# EAGLE design motor_driver (EAGLE 7.4.0)
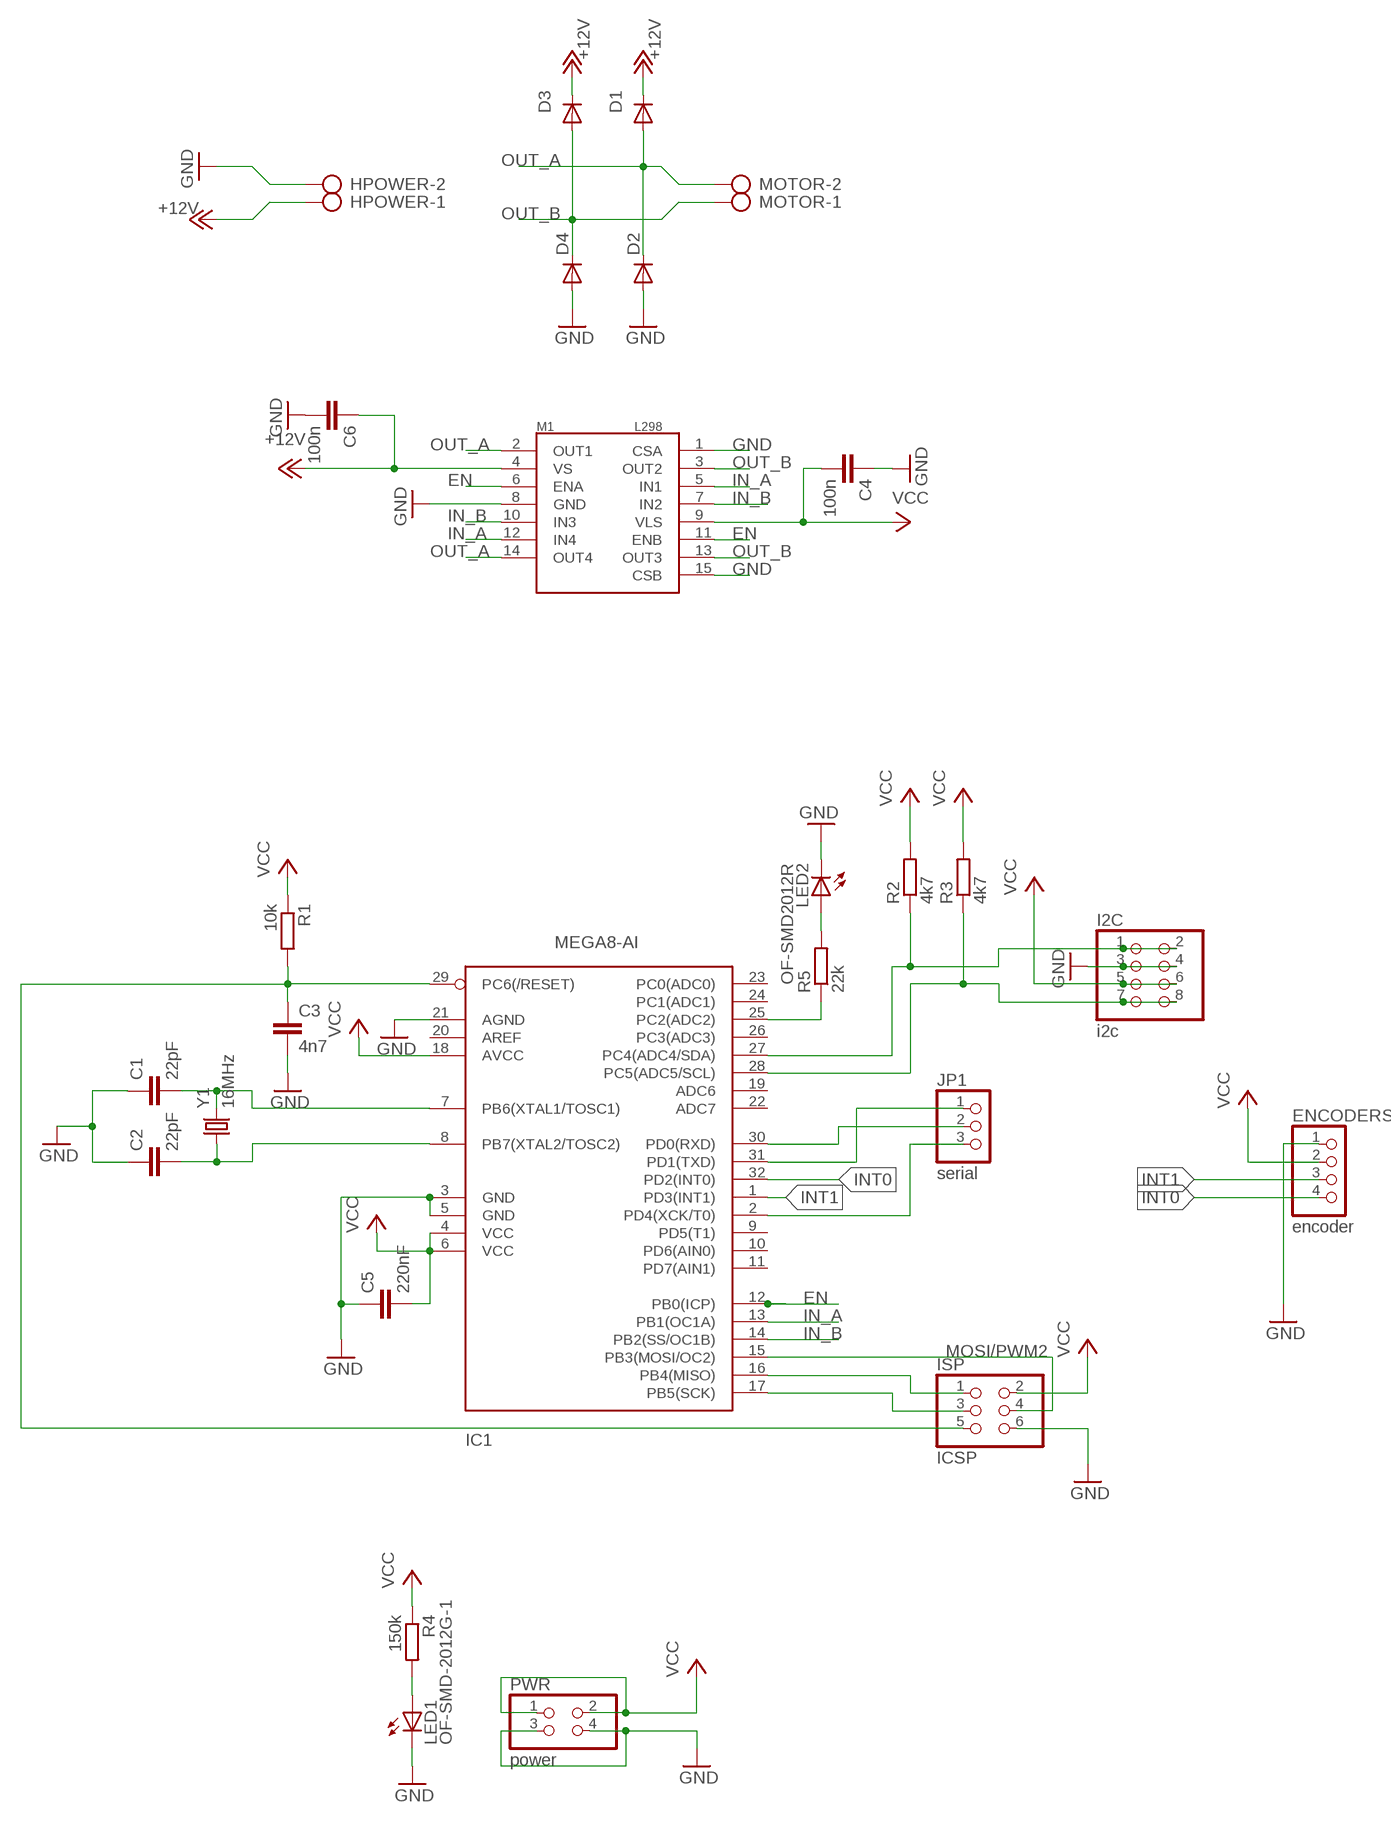
[diagram p0: schematic, sheet 1]

## Parts
C1  22pF  C  [C0805]
C2  22pF  C  [C0805]
C3  4n7  CAP0805  [0805]
C4  100n  CAP0805  [0805]
C5  220nF  CAP0805  [0805]
C6  100n  C  [C0805]
D1  DIODE-SMB  [SMB]
D2  DIODE-SMB  [SMB]
D3  DIODE-SMB  [SMB]
D4  DIODE-SMB  [SMB]
ENCODERS  encoder  PINHD-1X04_2.54-S  [1X04-S]
HPOWER  AK500/2  [AK500/2]
I2C  i2c  PINHD-2X04_2.54  [2X04]
IC1  MEGA8-AI  [TQFP32-08]
ISP  ICSP  PINHD-2X03_2.54  [2X03]
JP1  serial  PINHD-1X03_2.54-S  [1X03-S]
LED1  OF-SMD-2012G-1  LEDCHIPLED_1206  [CHIPLED_1206]
LED2  OF-SMD2012R  LEDCHIPLED_1206  [CHIPLED_1206]
M1  L298  [MULTIWATT15]
MOTOR  AK500/2  [AK500/2]
PWR  power  PINHD-2X02_2.54  [2X02]
R1  10k  R  [R0805]
R2  4k7  R  [R0805]
R3  4k7  R  [R0805]
R4  150k  R  [R0805]
R5  22k  R  [R0805]
Y1  16MHz  CRYSTALSMD  [HC49UP]

## Nets
+12V: C6.1 D1.C D3.C HPOWER.1 M1.4(VS)
EN: IC1.12(PB0(ICP)) M1.6(ENA) M1.11(ENB)
GND: C1.1 C2.1 C3.2 C4.1 C5.1 C6.2 D2.A D4.A ENCODERS.1 HPOWER.2 I2C.3 I2C.4 IC1.3(GND) IC1.5(GND) IC1.21(AGND) ISP.6 LED1.C LED2.C M1.1(CSA) M1.8(GND) M1.15(CSB) PWR.3 PWR.4
IN_A: IC1.13(PB1(OC1A)) M1.5(IN1) M1.12(IN4)
IN_B: IC1.14(PB2(SS/OC1B)) M1.7(IN2) M1.10(IN3)
INT0: ENCODERS.4 IC1.32(PD2(INT0))
INT1: ENCODERS.3 IC1.1(PD3(INT1))
MISO: IC1.16(PB4(MISO)) ISP.1
MOSI/PWM2: IC1.15(PB3(MOSI/OC2)) ISP.4
N$1: IC1.31(PD1(TXD)) JP1.1
N$2: C2.2 IC1.8(PB7(XTAL2/TOSC2)) Y1.1
N$3: C1.2 IC1.7(PB6(XTAL1/TOSC1)) Y1.2
N$5: IC1.30(PD0(RXD)) JP1.2
N$6: IC1.2(PD4(XCK/T0)) JP1.3
N$7: IC1.25(PC2(ADC2)) R5.1
N$11: LED1.A R4.2
N$14: LED2.A R5.2
OUT_A: D1.A D2.C M1.2(OUT1) M1.14(OUT4) MOTOR.2
OUT_B: D3.A D4.C M1.3(OUT2) M1.13(OUT3) MOTOR.1
RESET: C3.1 IC1.29(PC6(/RESET)) ISP.5 R1.2
SCK: IC1.17(PB5(SCK)) ISP.3
SCL: I2C.7 I2C.8 IC1.28(PC5(ADC5/SCL)) R3.1
SDA: I2C.1 I2C.2 IC1.27(PC4(ADC4/SDA)) R2.1
VCC: C4.2 C5.2 ENCODERS.2 I2C.5 I2C.6 IC1.4(VCC) IC1.6(VCC) IC1.18(AVCC) ISP.2 M1.9(VLS) PWR.1 PWR.2 R1.1 R2.2 R3.2 R4.1
Unconnected: IC1.9(PD5(T1)) IC1.10(PD6(AIN0)) IC1.11(PD7(AIN1)) IC1.19(ADC6) IC1.20(AREF) IC1.22(ADC7) IC1.23(PC0(ADC0)) IC1.24(PC1(ADC1)) IC1.26(PC3(ADC3))

## Library data of the parts
C1 C2 C6 = eagle-ltspice:C: CAPACITOR, European symbol; SPICEMODEL: NONE; SPICEPREFIX: C
C3-C5 = SparkFun-Capacitors:CAP: Capacitor Standard 0603 ceramic capacitor, and 0.1" leaded capacitor.
D1-D4 = diode:DIODE-: DIODE
ENCODERS = pinhead-2:PINHD-1X04: PIN HEADER
HPOWER MOTOR = con-ptr500:AK500/2: CONNECTOR; OC_FARNELL: unknown; OC_NEWARK: unknown
I2C = pinhead-2:PINHD-2X04: PIN HEADER
IC1 = avr-7:MEGA8: MICROCONTROLLER 8 Kbytes FLASH 1 kbytes SRAM 512 bytes EEPROM USART 6-channel 10 bit ADC 2-channel 8 bit ADC
ISP = pinhead-2:PINHD-2X03: PIN HEADER
JP1 = pinhead-2:PINHD-1X03: PIN HEADER
LED1 LED2 = adafruit:LED: LED OSRAM: - CHIPLED LG R971, LG N971, LY N971, LG Q971, LY Q971, LO R971, LY R971 LH N974, LH R974 LS Q976, LO Q976, LY Q976 LO Q996 - Hyper CHIPLED LW Q18S LB Q993, LB Q99A, LB R99A - SideLED LS A670, LO A670, LY A670, LG A670, LP A670 LB A673, LV A673, LT A673, LW A673 LH A674 LY A675 LS A676, LA A676, LO A676, LY A676, LW A676 LS A679, LY A679, LG A679 - Hyper Micro SIDELED® LS Y876, LA Y876, LO Y876, LY Y876 LT Y87S - SmartLED LW L88C, LW L88S LB L89C, LB L89S, LG L890 LS L89K, LO L89K, LY L89K LS L896, LA L896, LO L896, LY L896 - TOPLED LS T670, LO T670, LY T670, LG T670, LP T670 LSG T670, LSP T670, LSY T670, LOP T670, LYG T670 LG T671, LOG T671, LSG T671 LB T673, LV T673, LT T673, LW T673 LH T674 LS T676, LA T676, LO T676, LY T676, LB T676, LH T676, LSB T676, LW T676 LB T67C, LV T67C, LT T67C, LS T67K, LO T67K, LY T67K, LW E67C LS E67B, LA E67B, LO E67B, LY E67B, LB E67C, LV E67C, LT E67C LW T67C LS T679, LY T679, LG T679 LS T770, LO T770, LY T770, LG T770, LP T770 LB T773, LV T773, LT T773, LW T773 LH T774 LS E675, LA E675, LY E675, LS T675 LS T776, LA T776, LO T776, LY T776, LB T776 LHGB T686 LT T68C, LB T68C - Hyper Mini TOPLED® LB M676 - Mini TOPLED Santana® LG M470 LS M47K, LO M47K, LY M47K Source: http://www.osram.convergy.de/
M1 = SparkFun:L298: L298 Dual Full Bridge Driver
PWR = pinhead-2:PINHD-2X02: PIN HEADER
R1-R5 = eagle-ltspice:R: RESISTOR, European symbol; SPICEMODEL: NONE; SPICEPREFIX: R
Y1 = SparkFun-FreqCtrl:CRYSTAL: Various standard crystals. Proven footprints.

## Board
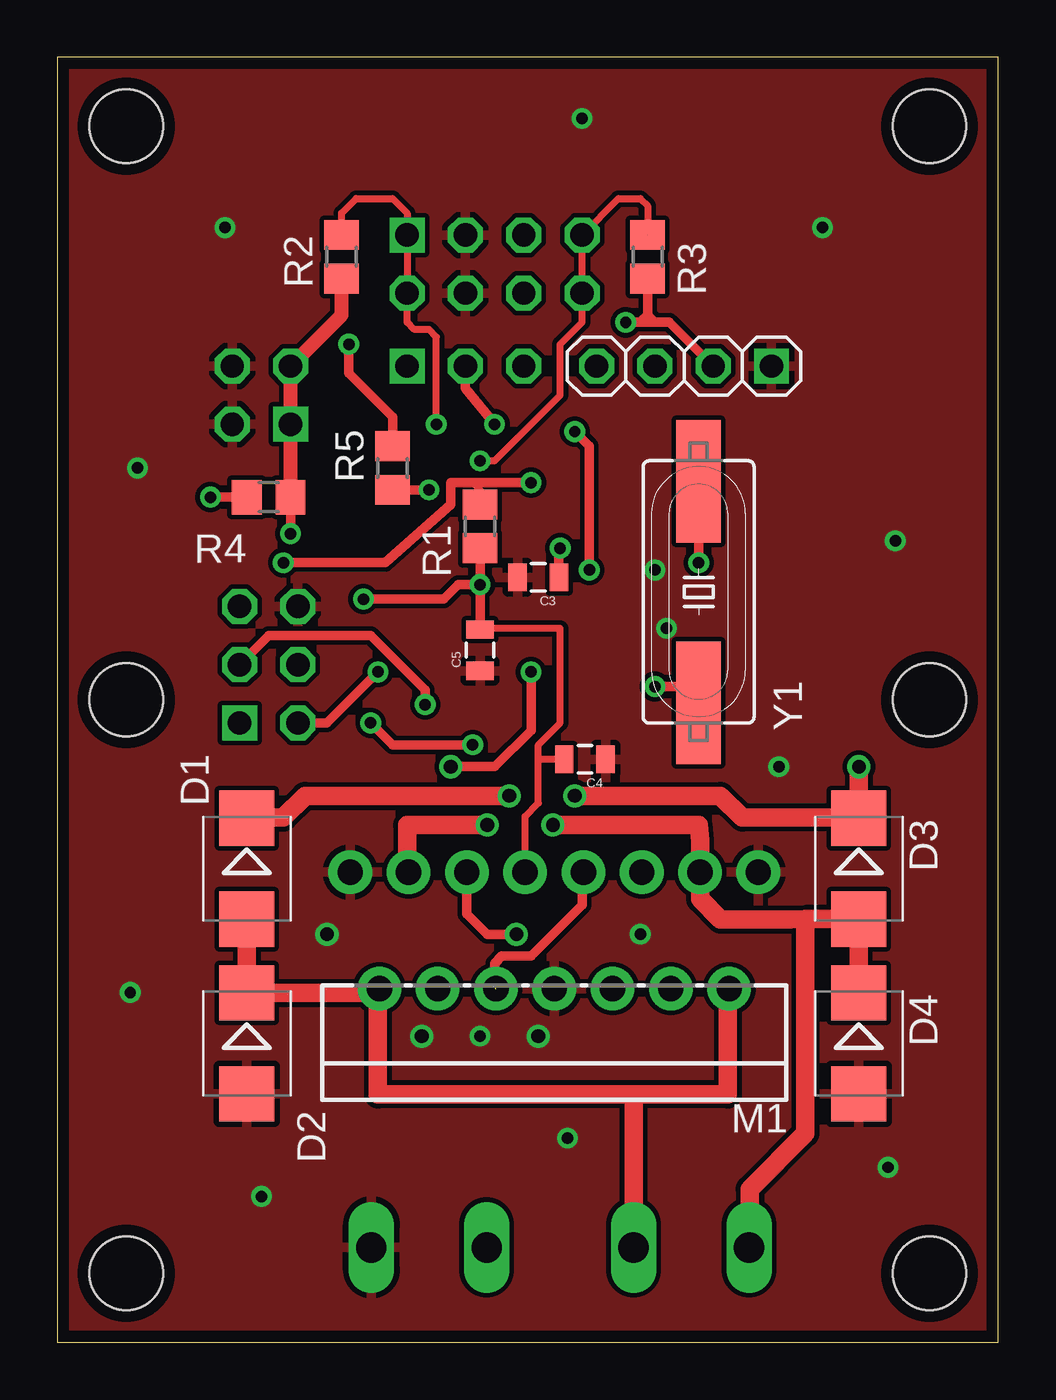
[diagram p1: board, top side]
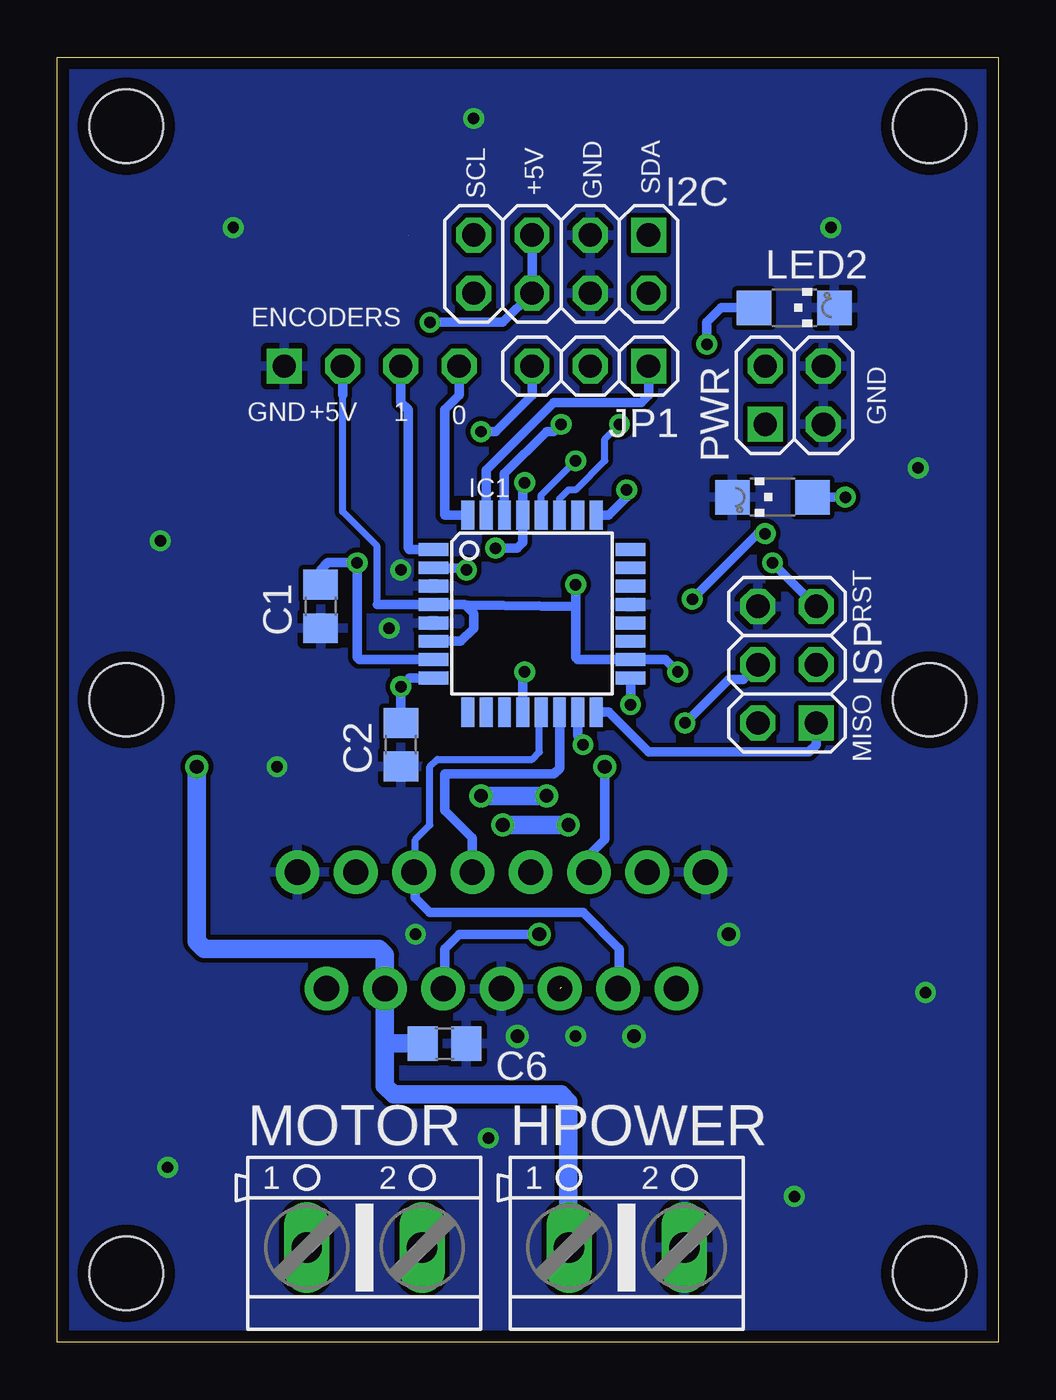
[diagram p2: board, bottom side, seen from below]

Size 41 x 56 mm. Coordinates in mm from the lower left corner, seen from the top.
Outline: 0,0 41,0 41,56 0,56 0,0
Copper layers (1*16): Top 0.035mm / dielectric 1.6mm / Bottom 0.035mm
Design rules "iteadstudio": minimum track width 8mil, minimum drill 12mil, track to track 8mil, track to pad 10mil, pad to pad 8mil, via to via 8mil, smd to smd 8mil, copper to edge 20mil, drill to drill 12mil, minimum pad ring 8mil, minimum via ring 8mil, stop-mask expansion 4mil, vias tented up to drill 0mil, thermal gap 10mil
Holes 3.2 mm at 3,3 38,3 38,53 3,53 38,28 3,28

### Footprints (pad centres in the part's own frame; a part is rotated, then mirrored left to right if it is on the bottom)
C0805 = smd 1.3 x 1.5: 1 -0.95,0; 2 0.95,0
0805 = smd 0.8 x 1.2: 1 -0.9,0; 2 0.9,0
SMB = smd 2.4 x 2.4: A 2.2,0; C -2.2,0
1X04-S = drill 1.016 square: 1 -3.81,0 | drill 1.016 octagon: 2 -1.27,0; 3 1.27,0; 4 3.81,0
AK500/2 = drill 1.321 long: 1 -2.515,0; 2 2.515,0
2X04 = drill 1.016 square: 1 -3.81,-1.27 | drill 1.016 octagon: 2 -3.81,1.27; 3 -1.27,-1.27; 4 -1.27,1.27; 5 1.27,-1.27; 6 1.27,1.27; 7 3.81,-1.27; 8 3.81,1.27
TQFP32-08 = smd 1.27 x 0.559: 1 -4.293,2.8; 2 -4.293,2; 3 -4.293,1.2; 4 -4.293,0.4; 5 -4.293,-0.4; 6 -4.293,-1.2; 7 -4.293,-2; 8 -4.293,-2.8; 17 4.293,-2.8; 18 4.293,-2; 19 4.293,-1.2; 20 4.293,-0.4; 21 4.293,0.4; 22 4.293,1.2; 23 4.293,2; 24 4.293,2.8 | smd 0.559 x 1.27: 9 -2.8,-4.293; 10 -2,-4.293; 11 -1.2,-4.293; 12 -0.4,-4.293; 13 0.4,-4.293; 14 1.2,-4.293; 15 2,-4.293; 16 2.8,-4.293; 25 2.8,4.293; 26 2,4.293; 27 1.2,4.293; 28 0.4,4.293; 29 -0.4,4.293; 30 -1.2,4.293; 31 -2,4.293; 32 -2.8,4.293
2X03 = drill 1.016 square: 1 -2.54,-1.27 | drill 1.016 octagon: 2 -2.54,1.27; 3 0,-1.27; 4 0,1.27; 5 2.54,-1.27; 6 2.54,1.27
1X03-S = drill 1.016 square: 1 -2.54,0 | drill 1.016 octagon: 2 0,0; 3 2.54,0
CHIPLED_1206 = smd 1.5 x 1.5: A 0,-1.75; C 0,1.75
MULTIWATT15 = drill 1.1 pad 1.9: 1 -8.95,-2.39; 2 -7.68,2.69; 3 -6.41,-2.39; 4 -5.14,2.69; 5 -3.87,-2.39; 6 -2.6,2.69; 7 -1.33,-2.39; 8 -0.06,2.69; 9 1.21,-2.39; 10 2.48,2.69; 11 3.75,-2.39; 12 5.02,2.69; 13 6.29,-2.39; 14 7.56,2.69; 15 8.83,-2.39
2X02 = drill 1.016 square: 1 -1.27,-1.27 | drill 1.016 octagon: 2 -1.27,1.27; 3 1.27,-1.27; 4 1.27,1.27
R0805 = smd 1.3 x 1.5: 1 -0.95,0; 2 0.95,0
HC49UP = smd 5.334 x 1.93: 1 -4.826,0; 2 4.826,0

### Placement (x,y rotation side)
C1  29.53,32.07 90 bottom
C2  26.04,26.04 90 bottom
C3  20.95,33.34 180 top
C4  22.99,25.4 180 top
C5  18.41,30.16 90 top
C6  24.13,13.02 0 bottom
D1  8.26,20.64 270 top
D2  8.26,13.02 270 top
D3  34.92,20.64 270 top
D4  34.92,13.02 270 top
ENCODERS  27.3,42.55 180 top
HPOWER  16.19,4.13 0 bottom
I2C  19.05,46.99 180 bottom
IC1  20.32,31.75 0 bottom
ISP  9.21,29.53 90 bottom
JP1  17.78,42.55 180 bottom
LED1  9.84,36.83 90 bottom
LED2  8.89,45.09 270 bottom
M1  21.59,18.1 180 top
MOTOR  27.62,4.13 0 bottom
PWR  8.89,41.27 0 bottom
R1  18.41,35.56 90 top
R2  12.38,47.31 270 top
R3  25.72,47.31 270 top
R4  9.21,36.83 180 top
R5  14.61,38.1 90 top
Y1  27.94,32.7 90 top

### Tracks (layer width: path | path; a pad name or v marks a point on that pad's centre or on a via)
+12V  (via drill 0.6 pad 0.3)
  Top 0.813: v19.68,23.81 10.79,23.81 9.84,22.86 8.28,22.86 D1.C | v34.92,25.08 D3.C 34.9,22.86 29.84,22.86 28.89,23.81 v22.54,23.81
  Bottom 0.813: v34.92,25.08 34.92,17.46 34.61,17.14 26.99,17.14 26.73,16.89 M1.4 26.73,13.02 | v19.68,23.81 v22.54,23.81 | 26.73,13.02 26.73,11.17 26.35,10.79 19.05,10.79 18.73,10.48 18.73,4.47 HPOWER.1 | C6.1 26.73,13.02
EN  (via drill 0.5 pad 0.25, 0.6 pad 0.3)
  Top 0.406: M1.11 17.84,18.67 18.73,17.78 v20,17.78 | v17.14,25.08 19.05,25.08 20.64,26.67 v20.64,29.21
  Bottom 0.406: M1.11 17.84,21.21 17.14,21.91 v17.14,25.08 | v20,17.78 23.5,17.78 24.13,17.14 24.13,15.47 M1.6 | IC1.12 20.72,29.13 v20.64,29.21
GND  (via drill 0.5, 0.5 pad 0.25, 0.6 pad 0.3)
  other vias: 11.75,17.78 15.88,13.34 20.95,13.34 26.54,31.11 26.04,33.66 25.4,17.78 18.41,13.34 33.34,48.58 31.43,25.08 22.23,8.89 36.51,34.92 36.2,7.62 7.3,48.58 8.89,6.35 22.86,53.34 3.49,38.1 3.17,15.24
  pour Top: -5.08,-5.08 -5.08,88.9 102.87,88.9 102.87,-10.16 -5.08,-10.16
  pour Bottom: -4.45,-3.49 -4.45,85.41 102.23,85.41 102.23,-8.57 -4.45,-8.57
IN_A
  Bottom 0.305: 25.4,20.55 25.4,21.91 24.77,22.54 24.77,25.08 24.45,25.4 20.32,25.4 20,25.72 20,27.38 IC1.13
  Bottom 0.406: M1.12 16.51,15.47 16.51,17.14 18.1,18.73 24.77,18.73 25.4,19.37 25.4,20.43 M1.5 25.4,20.55
IN_B  (1 unrouted)
  Top 0.406: 19.05,15.47 19.05,16.51 19.37,16.83 20.64,16.83 22.86,19.05 22.86,20.43 M1.7
  Bottom 0.406: M1.7 22.92,21.97 24.13,23.18 24.13,24.77 19.37,24.77 19.12,25.01 IC1.14
INT0
  Bottom 0.406: IC1.32 24.13,36.04 24.13,40.64 23.5,41.27 ENCODERS.4
INT1
  Bottom 0.406: IC1.1 25.66,34.55 25.72,34.61 25.72,40.64 26.04,40.96 ENCODERS.3
MISO
  Bottom 0.406: ISP.1 7.94,26.04 8.26,25.72 15.24,25.72 16.98,27.46 IC1.16
MOSI/PWM2  (via drill 0.5 pad 0.25)
  Top 0.406: v18.1,26.04 14.61,26.04 v13.65,26.99
  Bottom 0.406: IC1.15 18.32,26.45 v18.1,26.04 | v13.65,26.99 11.75,28.89 11.11,28.89 ISP.4
N$1
  Bottom 0.406: IC1.31 22.32,38.01 19.37,40.96 15.56,40.96 15.24,41.27 JP1.1
N$2  (via drill 0.5 pad 0.25)
  Top 0.406: v26.04,28.57 27.94,28.57 Y1.1
  Bottom 0.406: C2.2 v26.04,28.57 25.66,28.95 IC1.8
N$3  (via drill 0.5 pad 0.25)
  Top 0.406: v27.94,33.97 Y1.2
  Bottom 0.406: IC1.7 27.84,29.75 27.94,29.84 v27.94,33.97 29.21,33.97 29.53,33.66 C1.2
N$5  (via drill 0.5 pad 0.25)
  Top 0.406: v19.05,40.01 17.78,41.59 JP1.2
  Bottom 0.406: IC1.30 21.52,37.85 19.68,39.69 19.37,39.69 v19.05,40.01
N$6  (via drill 0.5, 0.5 pad 0.25)
  Top 0.406: v23.18,33.66 23.18,39.05 v22.54,39.69
  Bottom 0.406: IC1.2 23.27,33.75 v23.18,33.66 | v22.54,39.69 21.91,39.69 20.32,41.27 JP1.3
N$7  (via drill 0.5)
  Top 0.406: v16.19,37.15 R5.1
  Bottom 0.406: IC1.25 16.98,36.04 16.19,36.83 v16.19,37.15
N$11  (via drill 0.5 pad 0.25)
  Top 0.406: R4.2 v6.67,36.83
  Bottom 0.406: v6.67,36.83 LED1.A
N$14  (via drill 0.5)
  Top 0.406: R5.2 14.61,40.32 12.7,42.23 v12.7,43.5
  Bottom 0.406: LED2.A 12.06,45.09 12.7,44.45 v12.7,43.5
OUT_A
  Top 0.813: M1.2 29.21,15.41 29.21,10.79 25.08,10.79 | 25.08,10.79 13.97,10.79 13.97,15.41 M1.14 13.84,15.22 D2.C D1.A | MOTOR.2 25.11,10.77 25.08,10.79
OUT_B  (via drill 0.6 pad 0.3)
  Top 0.813: 32.59,18.44 D3.A D4.C | v21.59,22.54 27.94,22.54 28,21.85 M1.3 28,19.31 28.89,18.41 31.93,18.41 32.59,18.44 | v18.73,22.54 15.24,22.54 15.24,20.55 M1.13 | 32.59,18.44 32.59,9.1 30.16,6.67 30.16,4.15 MOTOR.1
  Bottom 0.813: v21.59,22.54 v18.73,22.54
RESET  (via drill 0.5 pad 0.25)
  Top 0.305: R1.2 18.41,37.15 18.1,37.47
  Top 0.406: C3.1 21.86,34.24 v21.91,34.61 | v20.64,37.47 18.1,37.47 17.14,37.47 17.14,36.51 14.29,33.97 v9.84,33.97
  Bottom 0.406: v21.91,34.61 20.95,34.61 20.72,34.84 IC1.29 20.72,37.38 v20.64,37.47 | ISP.5 v9.84,33.97
SCK  (via drill 0.5 pad 0.25)
  Top 0.406: ISP.3 9.21,30.8 13.65,30.8 16.03,28.42 v16.03,27.79
  Bottom 0.406: IC1.17 v16.03,27.79
SCL  (via drill 0.5)  (1 unrouted)
  Top 0.305: R3.1 25.72,49.53 25.4,49.85 24.45,49.85 I2C.7 I2C.8 22.86,44.45 21.91,43.5 21.91,41.27 19.05,38.42 v18.41,38.42
  Bottom 0.305: IC1.28 19.92,36.91 v18.41,38.42
SDA  (via drill 0.5)
  Top 0.305: R2.1 12.38,49.21 13.02,49.85 14.61,49.85 15.24,49.21 I2C.1 I2C.2 15.24,44.45 15.56,44.13 16.19,44.13 16.51,43.81 v16.51,40.01
  Bottom 0.305: IC1.27 19.12,36.76 18.73,37.15 18.41,37.15 17.14,38.42 17.14,39.37 v16.51,40.01
VCC  (via drill 0.5, 0.5 pad 0.25)
  Top 0.305: C5.2 18.47,31.11 21.91,31.11 21.91,26.99 20.95,26.04 20.95,25.4 | M1.9 20.38,22.92 20.95,23.5 20.95,25.4 | C4.2 20.95,25.4
  Top 0.406: v18.41,33.02 C5.2 | v18.41,33.02 R1.1 | R4.1 v10.16,35.24 | ISP.2 11.75,26.99 v13.97,29.21 | v13.34,32.38 16.83,32.38 17.46,33.02 v18.41,33.02 | ENCODERS.2 26.67,44.45 26.04,44.45 | 26.04,44.45 25.72,44.77 | R3.2 25.72,44.77 | 25.72,44.77 25.72,44.45 | 25.72,44.45 25.4,44.45 | 25.4,44.45 v24.77,44.45 | 25.72,44.45 26.04,44.45 | 25.72,44.77 25.4,44.45
  Top 0.61: R4.1 PWR.1 PWR.2 12.38,44.77 R2.2
  Bottom 0.305: 27.07,32.15 27.07,34.69 28.57,36.2 ENCODERS.2
  Bottom 0.406: 18.41,32.07 18.41,29.84 18.32,29.75 IC1.18 14.51,29.75 v13.97,29.21 | 18.41,32.07 v18.41,33.02 | IC1.4 18.41,32.07 | IC1.4 23.26,32.15 22.86,31.75 22.86,31.11 23.43,30.55 IC1.6 | IC1.4 27.07,32.15 | 28.57,41.27 ENCODERS.2 | v10.16,35.24 10.48,35.24 v13.34,32.38 | v24.77,44.45 21.59,44.45 I2C.6 I2C.5

### Text on the board
bNames: SDA | GND | +5V | SCL | ENCODERS | GND | 1 | +5V | GND | 0 | RST | MISO